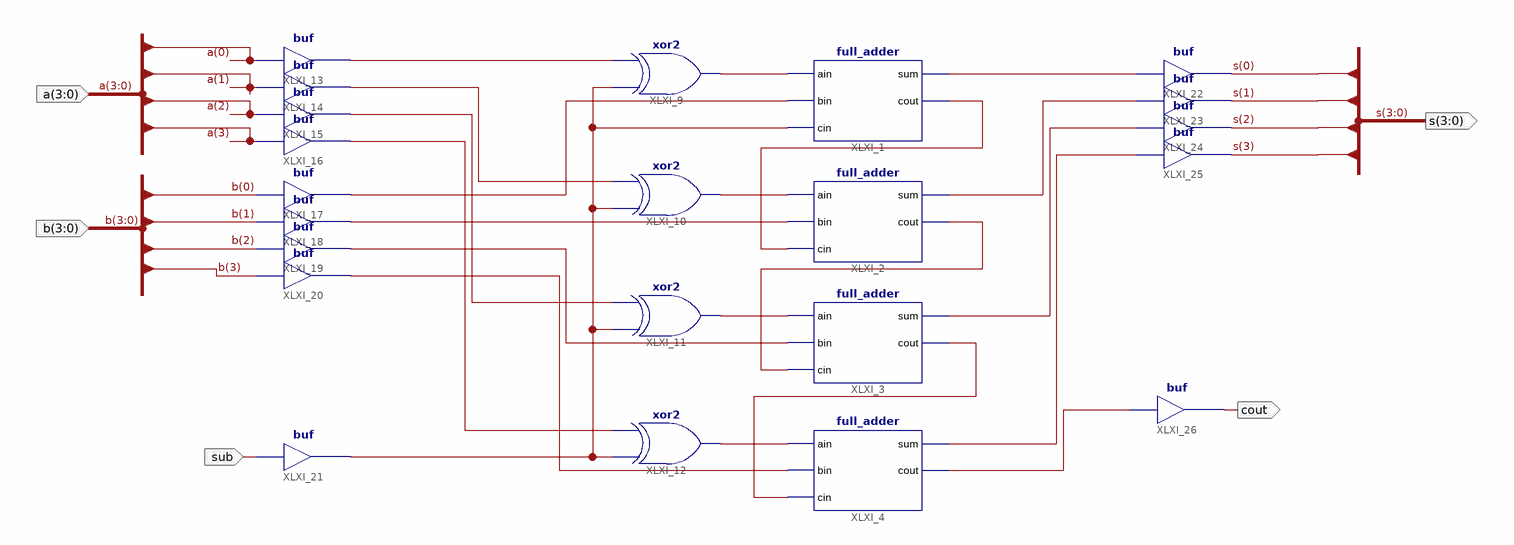
[diagram p0: schematic sheet 1]
// Xilinx ISE schematic fourbit_addsub.sch (spartan3e) as structural Verilog: 22 symbols, 5 ports
module fourbit_addsub (
  input  [3:0] b,
  input  sub,
  input  [3:0] a,
  output cout,
  output [3:0] s
);

  wire XLXN_1, XLXN_2, XLXN_3, XLXN_4, XLXN_5, XLXN_10, XLXN_11, XLXN_12, XLXN_13, XLXN_14, XLXN_15, XLXN_16,
       XLXN_17, XLXN_18, XLXN_19, XLXN_20, XLXN_21, XLXN_22, XLXN_23, XLXN_24, XLXN_25;

  full_adder XLXI_1 (.ain(XLXN_1), .bin(XLXN_14), .cin(XLXN_5), .cout(XLXN_18), .sum(XLXN_21));
  full_adder XLXI_2 (.ain(XLXN_2), .bin(XLXN_15), .cin(XLXN_18), .cout(XLXN_19), .sum(XLXN_22));
  full_adder XLXI_4 (.ain(XLXN_4), .bin(XLXN_17), .cin(XLXN_20), .cout(XLXN_25), .sum(XLXN_24));
  full_adder XLXI_3 (.ain(XLXN_3), .bin(XLXN_16), .cin(XLXN_19), .cout(XLXN_20), .sum(XLXN_23));
  buf XLXI_26 (cout, XLXN_25);
  xor XLXI_9 (XLXN_1, XLXN_5, XLXN_10);
  xor XLXI_10 (XLXN_2, XLXN_5, XLXN_11);
  xor XLXI_11 (XLXN_3, XLXN_5, XLXN_12);
  xor XLXI_12 (XLXN_4, XLXN_5, XLXN_13);
  buf XLXI_13 (XLXN_10, a[0]);
  buf XLXI_14 (XLXN_11, a[1]);
  buf XLXI_15 (XLXN_12, a[2]);
  buf XLXI_16 (XLXN_13, a[3]);
  buf XLXI_21 (XLXN_5, sub);
  buf XLXI_17 (XLXN_14, b[0]);
  buf XLXI_18 (XLXN_15, b[1]);
  buf XLXI_19 (XLXN_16, b[2]);
  buf XLXI_20 (XLXN_17, b[3]);
  buf XLXI_22 (s[0], XLXN_21);
  buf XLXI_23 (s[1], XLXN_22);
  buf XLXI_24 (s[2], XLXN_23);
  buf XLXI_25 (s[3], XLXN_24);
endmodule
